# EasyEDA Pro project ProPrj_农装B类小车V2_2025-10-25.epro, board PCB7
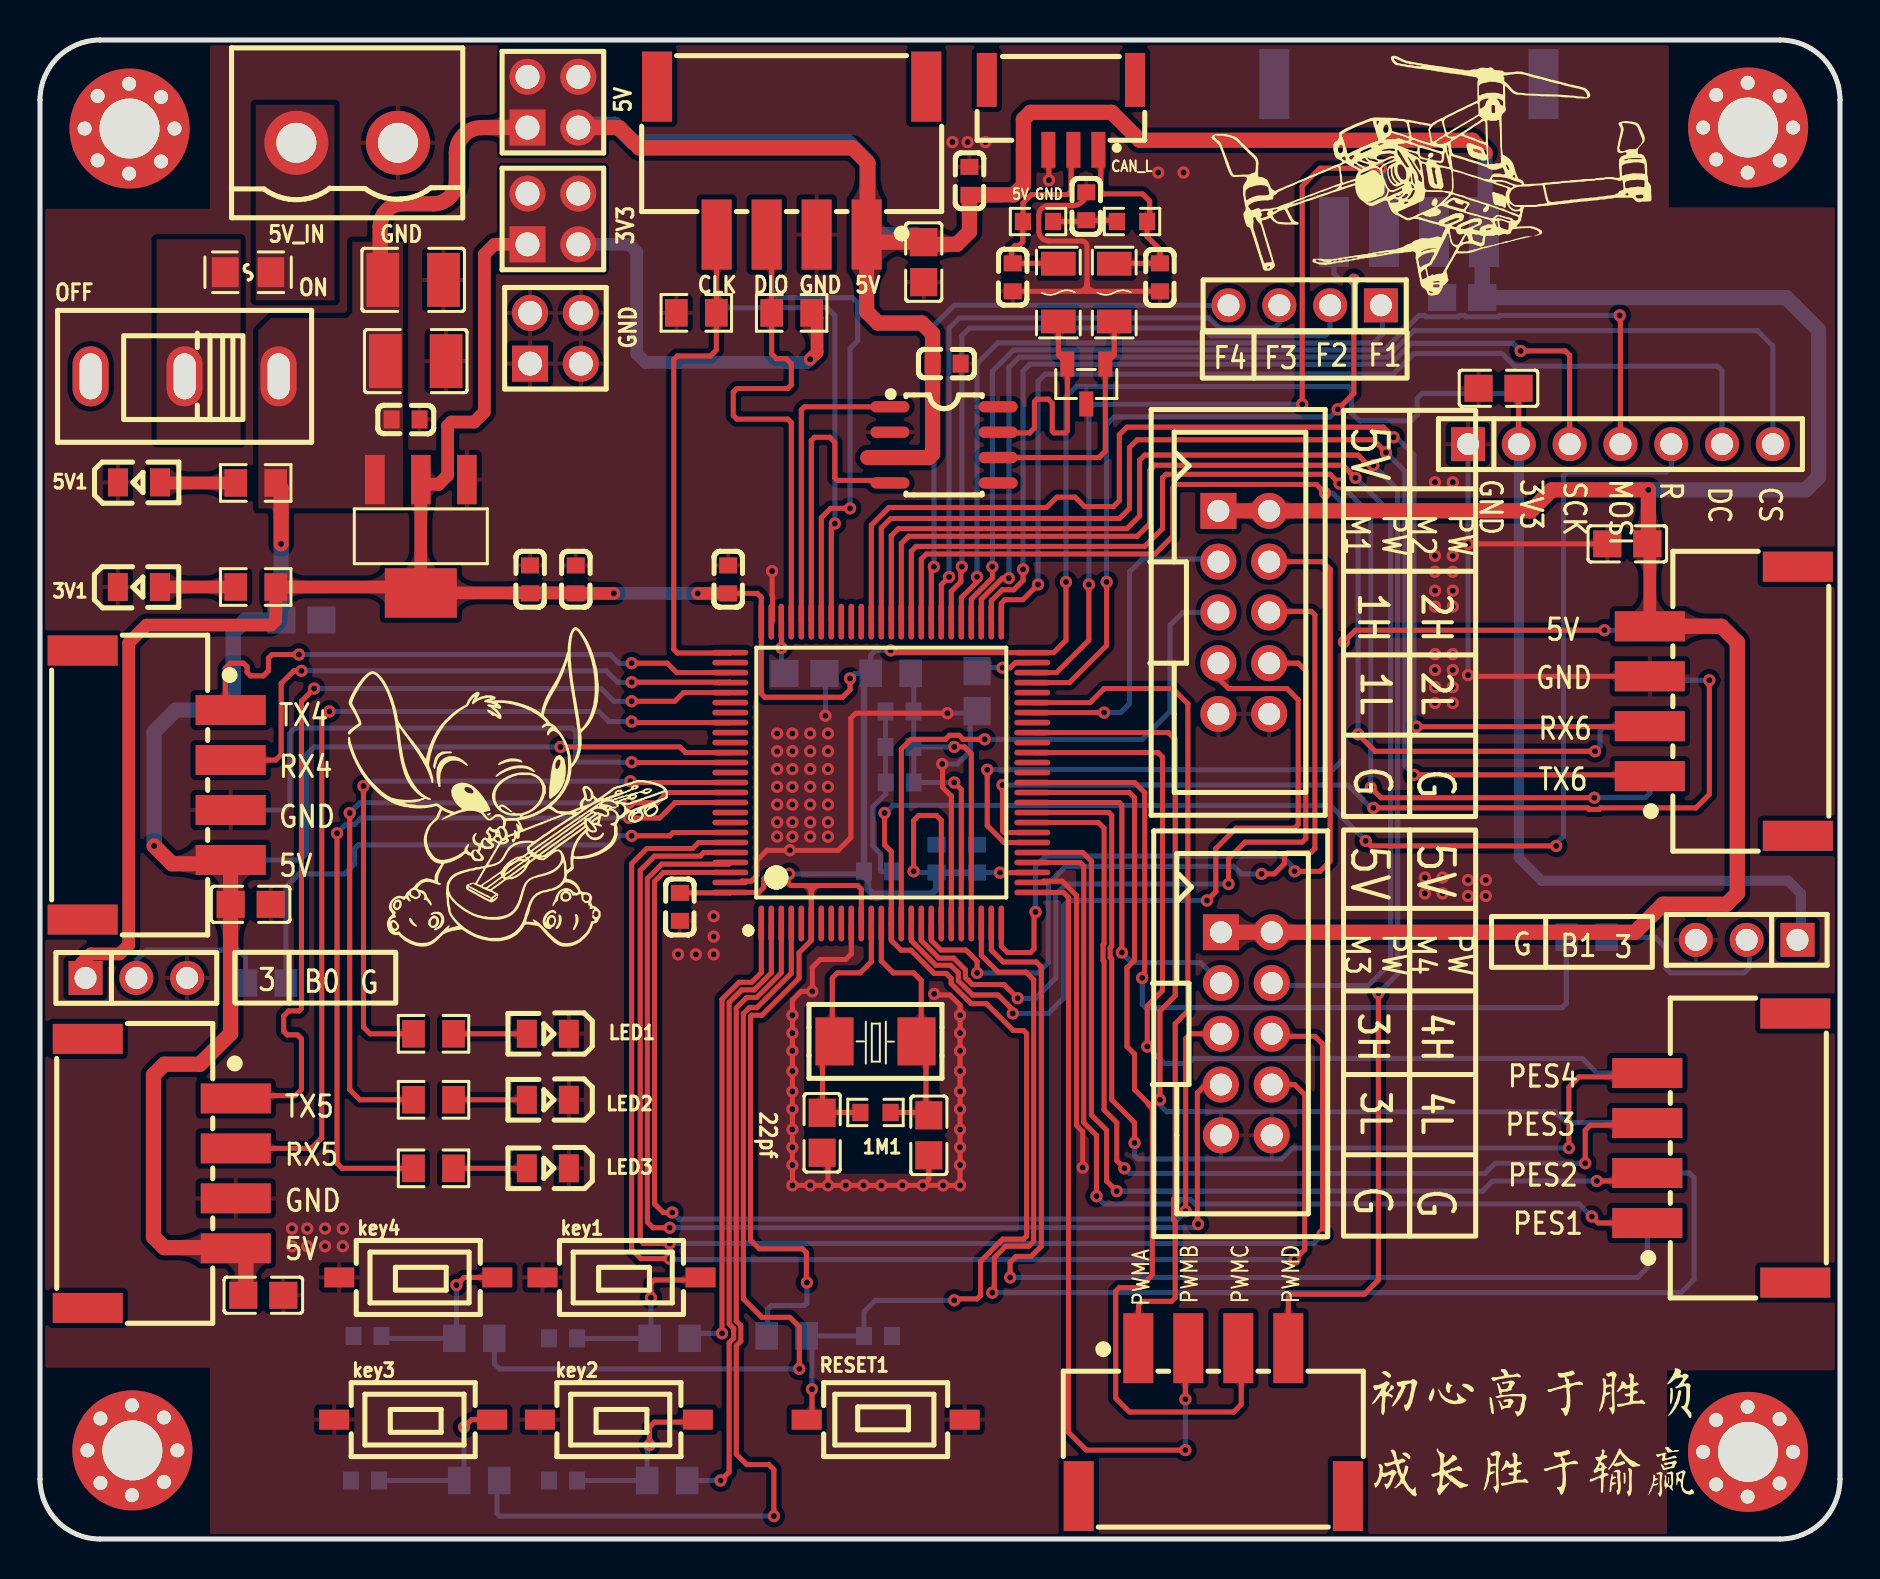
[diagram p2: board, top side]
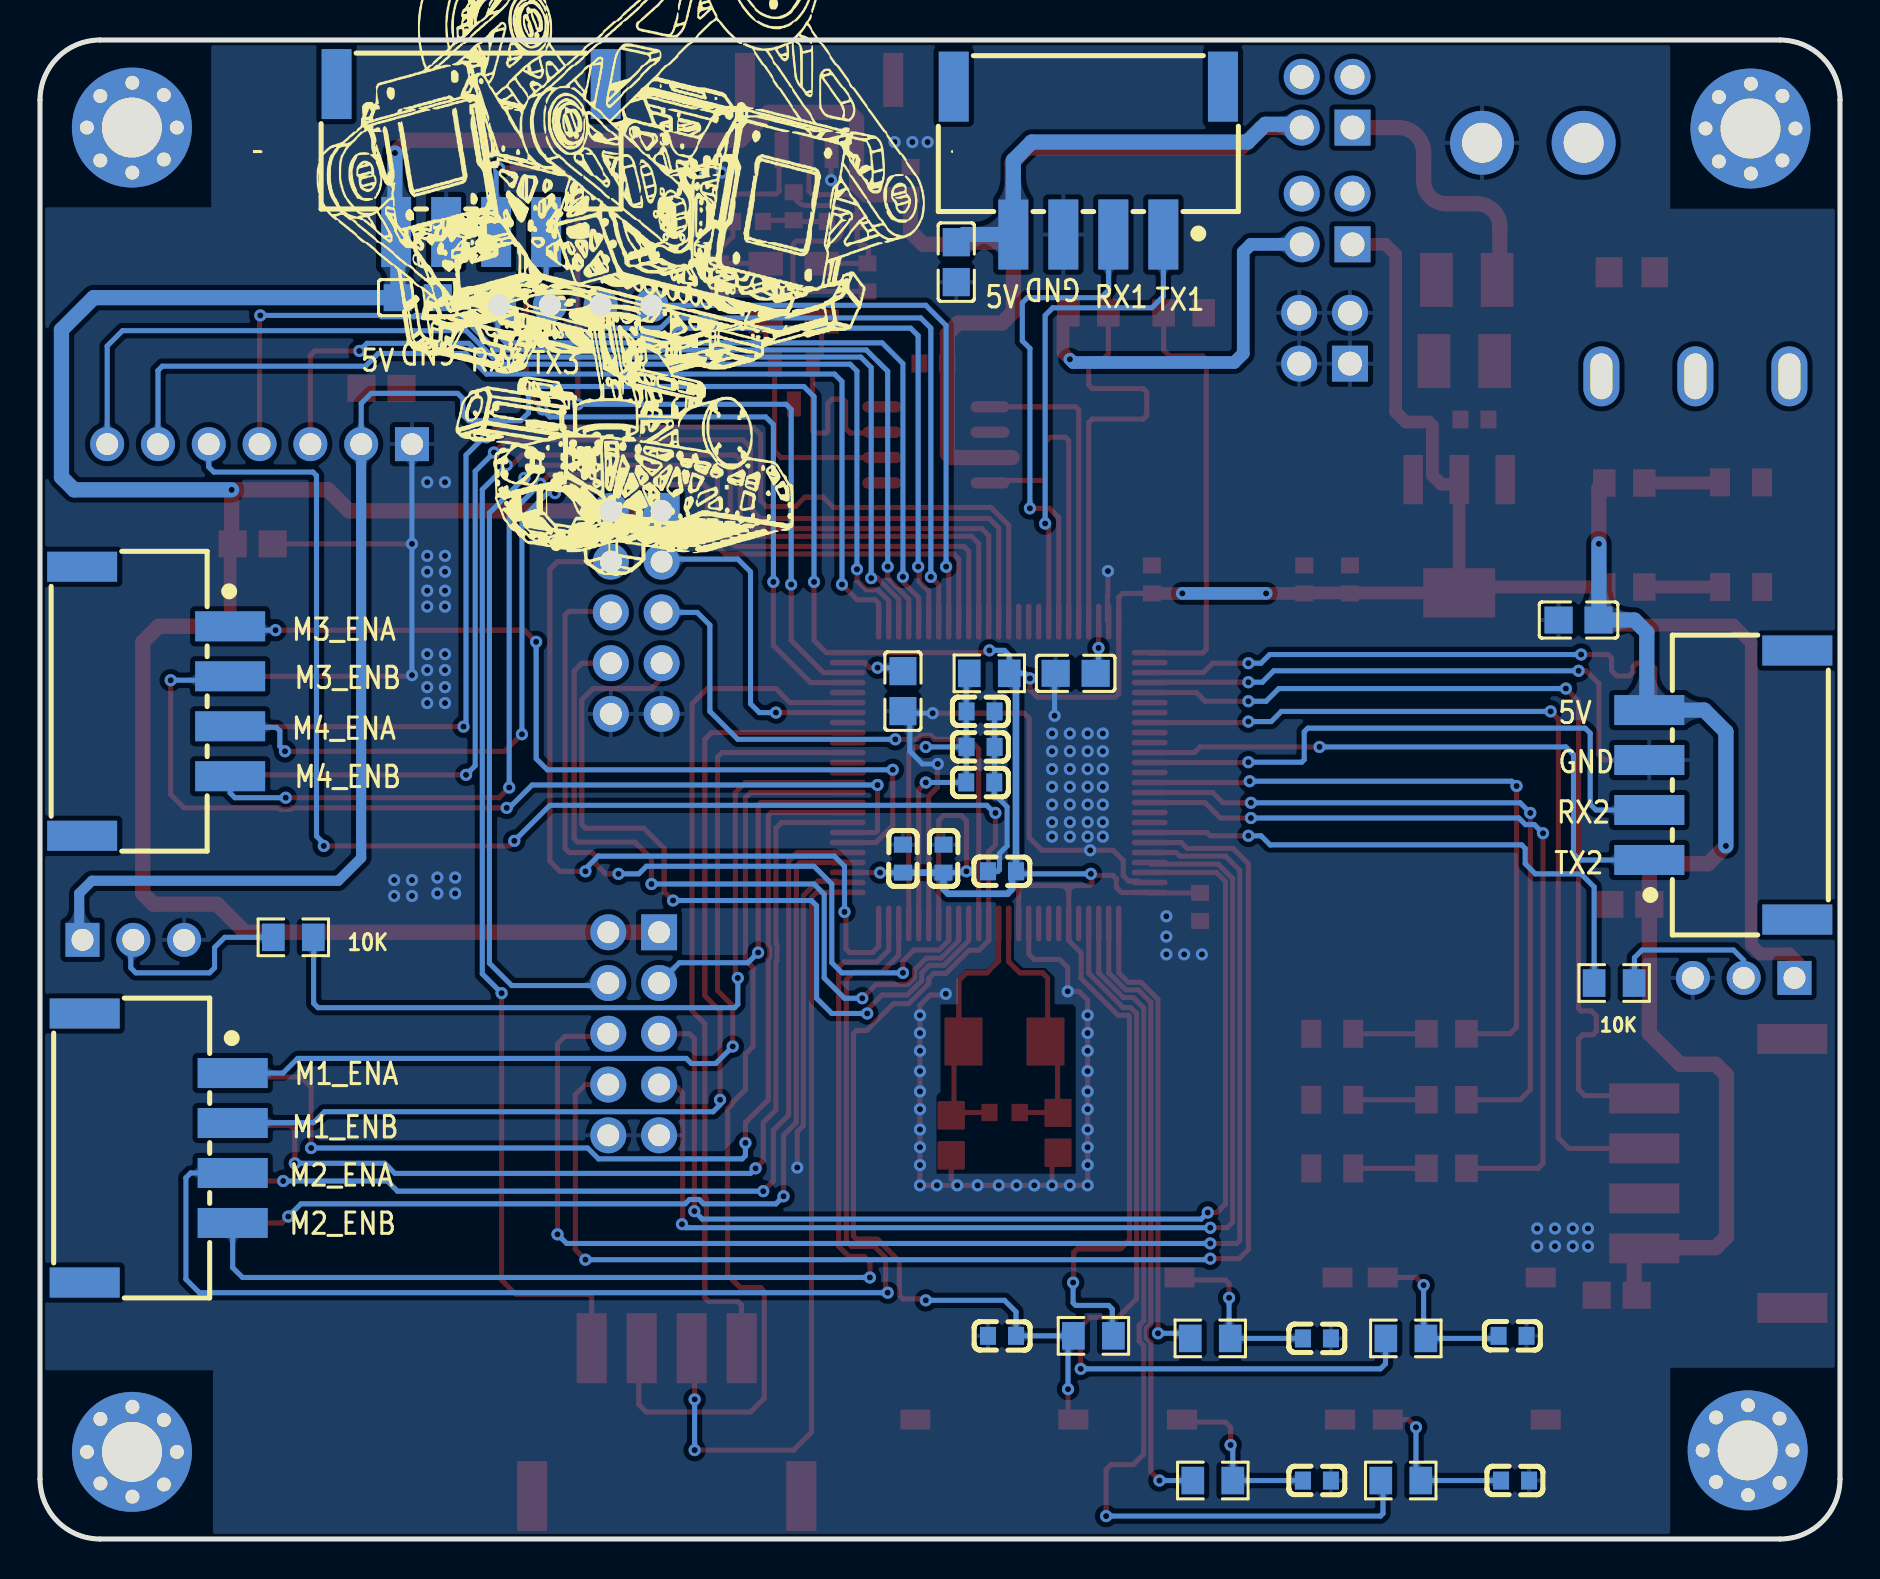
[diagram p3: board, bottom side, seen from below]

Outline 90 x 75 mm; copper layers: Top Layer, Bottom Layer. Coordinates in mm from the lower left corner of the outline.
Outline path: 0,72 arc(0.88,74.12) 3,75 87,75 arc(89.12,74.12) 90,72 90,3 arc(89.12,0.88) 87,0 3,0 arc(0.88,0.88) 0,3 0,72
Stack: Top Layer 0.035mm / Dielectric1 1.51mm FR4 er 4.5 / Bottom Layer 0.035mm

## Design rules (mm)
net OSC_OUT: DP1
net OSC_IN: DP1
net CAN1_L: DP4
net CAN1_H: DP4
net USART2_TX: DP7
net USART2_RX: DP7
net USART1_TX: DP6
net USART1_RX: DP6
net USART4_TX: DP8
net USART4_RX: DP8
net SWDIO: DP3
net SWCLK: DP3
net USART5_TX: DP9
net USART5_RX: DP9
net USART6_TX: DP10
net USART6_RX: DP10
net $1N59236: DP5
net $1N59237: DP5
net CAN1_RX: DP2
net CAN1_TX: DP2
template: 自定义配置
spacing copperThickness1oz (default): track to track 0.102, other pairs 0.152 to 0.3
spacing copperThickness2oz: track to track 0.203, other pairs 0.152 to 0.3
track width copperThickness1oz (default): min 0.127, default 0.254, max 2.54
track width copperThickness2oz: min 0.203, default 0.254, max 2.54
differential pair differentialPair (default): width min 0.127, default 0.254, max 2.54; gap min 0.152, default 0.152
via viaSize (default): diameter min 0.5, default 0.61, max 10; hole min 0.3, default 0.305, max 6.3
net $1N12322 uses copperRegion1

## Placement (name value [footprint] x y rotation side)
1M1  SCR0603J1K  [R0603]  41.77 21.34 0 top
3V1  NCD0805R1  [LED0805-R-RD]  4.94 47.63 0 top
5V1  NCD0805R1  [LED0805-R-RD]  4.95 52.86 0 top
10K  10K  [R0805]  11.29 27.82 180 bottom
C1  104  [C0603]  26.15 10.04 180 bottom
C1_22pf1  22pf  [C0805]  44.44 20.2 90 top
C2_22pf1  100nF  [C0805]  39.11 20.32 90 top
C5  104  [C0603]  46.85 34.04 270 bottom
C6  104  [C0603]  44.82 34.04 270 bottom
C7  104  [C0603]  32 31.63 90 top
C8  104  [C0603]  34.41 48.01 270 top
C9  104  [C0603]  41.9 33.41 180 bottom
C10  106  [C0603]  26.79 48.01 270 top
C22  104  [C0603]  45.33 58.81 0 top
C24  104  [C0805]  44.19 63.89 90 bottom
C25  104  [C0805]  72.93 57.57 0 top
C26  22p  [C0603]  56 63.12 90 top
C27  22p  [C0603]  52.31 66.68 90 top
C33_2.2uf1  100nF  [C0603]  42.99 37.85 0 bottom
C34_106  106  [C0603]  42.97 39.63 180 bottom
C35_104  104  [C0603]  42.97 41.41 180 bottom
C39  104  [C0603]  41.9 10.16 0 bottom
C40  104  [C0805]  44.19 63.89 270 top
C41  104  [C0805]  13.07 45.98 180 bottom
C42  104  [C0805]  71.11 62.11 0 bottom
C43  104  [C0805]  10.53 31.75 180 top
C44  2.2uf  [C0805]  46.85 42.42 270 bottom
C45  2.2uf  [C0805]  38.22 43.31 0 bottom
C52  104  [C0603]  18.28 56.01 180 top
C53  104  [C0603]  24.5 48.01 270 top
C54  100uF  [C1210]  18.66 63 0 top
C55  100uF  [C1210]  18.79 58.93 0 top
C56  104  [C0603]  26.15 2.93 180 bottom
C57  104  [C0603]  16.25 2.93 180 bottom
C58  104  [C0603]  16.37 10.16 180 bottom
C61  104  [C0805]  11.17 12.2 180 top
C63  104  [C0805]  79.37 49.79 0 top
C64  22p  [C0603]  48.63 63.12 270 top
C65  104  [C0603]  46.47 67.95 270 top
CN2  WAFER-XH2.54-4PWB  [CONN-TH_4P-P0.20_XUNPU_WAFER-XH2.54-4PWB]  5.83 37.72 90 bottom
CN3  WAFER-XH2.54-4PWB  [CONN-TH_4P-P0.20_XUNPU_WAFER-XH2.54-4PWB]  37.58 68.97 0 bottom
CN4  WAFER-XH2.54-4PWB  [CONN-TH_4P-P0.20_XUNPU_WAFER-XH2.54-4PWB]  68.44 69.09 0 bottom
CN5  WAFER-XH2.54-4PWB  [CONN-TH_4P-P0.20_XUNPU_WAFER-XH2.54-4PWB]  5.83 37.72 270 top
CN6  WAFER-XH2.54-4PWB  [CONN-TH_4P-P0.20_XUNPU_WAFER-XH2.54-4PWB]  37.58 68.97 180 top
CN15  WAFER-XH2.54-4PWB  [CONN-TH_4P-P0.20_XUNPU_WAFER-XH2.54-4PWB]  84.06 19.56 90 top
CN16  WAFER-XH2.54-4PWB  [CONN-TH_4P-P0.20_XUNPU_WAFER-XH2.54-4PWB]  58.66 5.85 0 top
CN24  DB2EVC-5.08-2P-GN  [CONN-TH_2P-P5.08_DB2EVC-5.08-2P]  15.36 69.85 180 top
CN25  WAFER-XH2.54-4PWB  [CONN-TH_4P-P0.20_XUNPU_WAFER-XH2.54-4PWB]  6.09 18.29 270 top
CN26  BH254V-10P  [IDC-TH_10P-P2.54-V-R2-C5-S2.54]  60.19 46.36 270 top
CN28  BH254V-10P  [IDC-TH_10P-P2.54-V-R2-C5-S2.54]  60.32 25.28 270 top
CN29  WAFER-XH2.54-4PWB  [CONN-TH_4P-P0.20_XUNPU_WAFER-XH2.54-4PWB]  84.19 41.91 90 top
CN30  WAFER-XH2.54-4PWB  [CONN-TH_4P-P0.20_XUNPU_WAFER-XH2.54-4PWB]  84.06 19.56 270 bottom
CN31  WAFER-XH2.54-4PWB  [CONN-TH_4P-P0.20_XUNPU_WAFER-XH2.54-4PWB]  84.19 41.91 270 bottom
CN32  GH125-S04DCA-00  [CONN-SMD_4P-P1.27_GH125-S04DCA-00]  51.05 71.25 180 top
D1  NUP2105LT1G-TP  [SOT-23-3_L2.9-W1.3-P1.90-LS2.4-BR]  52.31 57.79 90 top
F1  BSMD0805-100-6V  [F0805]  10.41 63.38 0 top
F3  nSMD020-30V  [F1206]  53.71 62.36 90 top
F4  nSMD020-30V  [F1206]  50.92 62.36 90 top
H7  H3  [HDR-TH_3P-P2.54-V-M]  4.82 28.07 0 top
H8  H3  [HDR-TH_3P-P2.54-V-M]  85.34 29.98 180 top
H25  PZ254V-11-07P  [HDR-TH_7P-P2.54-V-M]  79.02 54.78 0 top
H26  A2541WV-2x2P  [HDR-TH_4P-P2.54-V-R2-C2-S2.54_A2541WV-2X2P]  25.77 60.08 0 top
H27  A2541WV-2x2P  [HDR-TH_4P-P2.54-V-R2-C2-S2.54_A2541WV-2X2P]  25.64 71.89 0 top
H28  A2541WV-2x2P  [HDR-TH_4P-P2.54-V-R2-C2-S2.54_A2541WV-2X2P]  25.64 66.04 0 top
H29  PZ254V-11-04P  [HDR-TH_4P-P2.54-V-M]  63.24 61.73 180 top
key1  TS-1092S-B3D2-G  [SW-SMD_L6.1-W3.6-LS7.9]  29.07 13.09 180 top
key2  TS-1092S-B3D2-G  [SW-SMD_L6.1-W3.6-LS7.9]  28.95 5.97 180 top
key3  TS-1092S-B3D2-G  [SW-SMD_L6.1-W3.6-LS7.9]  18.66 5.97 180 top
key4  TS-1092S-B3D2-G  [SW-SMD_L6.1-W3.6-LS7.9]  18.91 13.09 180 top
LED1  NCD0805R1  [LED0805-R-RD]  25.39 25.28 180 top
LED2  NCD0805R1  [LED0805-R-RD]  25.39 21.98 180 top
LED3  NCD0805R1  [LED0805-R-RD]  25.39 18.55 180 top
NOREF  -  [Pad_e4715]  83.81 69.02 180 top
NOREF#2  -  [Pad_e4723]  86.98 2.78 0 top
NOREF#3  -  [Pad_e4727]  83.81 5.96 0 top
NOREF#4  -  [Pad_e4725]  83.81 2.73 0 top
NOREF#5  -  [Pad_e108]  4.6 2.2 180 top
NOREF#6  -  [Pad_e4701]  2.23 70.57 270 top
NOREF#7  -  [Pad_e104]  4.6 6.69 180 top
NOREF#8  -  [Pad_e4703]  6.06 68.92 180 top
NOREF#9  -  [Pad_e4712]  87.66 70.62 270 top
NOREF#10  -  [Pad_e4710]  85.38 72.86 0 top
NOREF#11  -  [Pad_e4698]  4.45 72.81 0 top
NOREF#12  -  [Pad_e4717]  83.81 72.25 180 top
NOREF#13  -  [Pad_e4714]  85.38 68.36 0 top
NOREF#14  -  [Pad_e4713]  86.98 68.97 180 top
NOREF#15  -  [Pad_e112]  4.62 4.44 180 top
NOREF#16  -  [Pad_e4721]  86.98 6.01 0 top
NOREF#17  -  [Pad_e4728]  85.38 6.62 180 top
NOREF#18  -  [Pad_e107]  3.02 2.81 0 top
NOREF#19  -  [Pad_e109]  6.2 2.86 0 top
NOREF#20  -  [Pad_e4699]  2.88 72.2 180 top
NOREF#21  -  [Pad_e4697]  6.06 72.15 180 top
NOREF#22  -  [Pad_e4729]  85.4 4.36 180 top
NOREF#23  -  [Pad_e4718]  85.41 70.62 0 top
NOREF#24  -  [Pad_e4705]  4.48 70.57 0 top
NOREF#25  -  [Pad_e4726]  83.16 4.36 270 top
NOREF#26  -  [Pad_e4724]  85.38 2.12 180 top
NOREF#27  -  [Pad_e111]  6.2 6.08 0 top
NOREF#28  -  [Pad_e4722]  87.65 4.36 270 top
NOREF#29  -  [Pad_e4711]  86.98 72.2 180 top
NOREF#30  -  [Pad_e4704]  6.73 70.57 270 top
NOREF#31  -  [Pad_e4716]  83.16 70.62 270 top
NOREF#32  -  [Pad_e105]  3.02 6.03 0 top
NOREF#33  -  [Pad_e106]  2.37 4.44 270 top
NOREF#34  -  [Pad_e4702]  4.45 68.31 0 top
NOREF#35  -  [Pad_e4700]  2.88 68.97 180 top
NOREF#36  -  [Pad_e110]  6.87 4.44 270 top
R6_1k1  1K  [R0805]  31.49 10.04 180 bottom
R7_1K1  1K  [R0805]  31.36 2.93 180 bottom
R8_1K1  1K  [R0805]  21.96 2.93 180 bottom
R10_2K1  2K  [R0805]  19.68 21.98 0 top
R10_2K2  2K  [R0805]  19.68 18.55 0 top
R10_10K1  10K  [R0805]  10.79 47.63 180 top
R10_10K2  10K  [R0805]  37.58 61.35 180 top
R10_10K3  10K  [R0805]  32.82 61.35 0 top
R13_2K1  2K  [R0805]  19.68 25.28 0 top
R13_10K1  10K  [R0805]  10.79 52.84 180 top
R19  60R  [R0603]  49.9 65.92 180 top
R20  60R  [R0603]  54.6 65.92 180 top
R27_0Ω1  0K  [R0805]  42.54 43.31 0 bottom
R29_10K1  10K  [R0805]  77.33 30.1 0 bottom
R30  10K  [R0805]  37.33 10.16 0 bottom
R31_1K1  1K  [R0805]  21.71 10.04 180 bottom
RESET1  TS-1092S-B3D2-G  [SW-SMD_L6.1-W3.6-LS7.9]  42.28 5.97 0 top
U3  单刀双掷  [SW-TH_SS-12D10-G050]  7.23 58.17 180 top
U4  -  [407vgt6]  43.68 39.88 45 top
U10  SK12D07VG3  [SOT-223-4_L6.5-W3.5-P2.30-LS7.0-BR]  19.04 50.17 90 top
U13  TJA1050T/CM,118  [SOIC-8_L5.0-W4.0-P1.27-LS6.0-BL]  45.2 54.74 270 top
X1  8MHz  [CRYSTAL-SMD_L5.0-W3.2]  41.77 24.9 0 top

## Footprints (pads in the part's own frame, mm; a bottom-side part is the same pattern mirrored in y, then rotated)
407vgt6
  oval 0.28x1.796 smd rot 135: 1(-11.809,-1.04) 2(-11.456,-1.393) 3(-11.101,-1.747) 4(-10.748,-2.1) 5(-10.394,-2.454) 6(-10.041,-2.808) 7(-9.687,-3.161) 8(-9.334,-3.514) 9(-8.98,-3.868) 10(-8.627,-4.221) 11(-8.273,-4.575) 12(-7.92,-4.929) 13(-7.566,-5.282) 14(-7.213,-5.636) 15(-6.859,-5.989) 16(-6.505,-6.343) 17(-6.152,-6.697) 18(-5.798,-7.05) 19(-5.445,-7.404) 20(-5.091,-7.757) 21(-4.737,-8.111) 22(-4.384,-8.464) 23(-4.03,-8.818) 24(-3.677,-9.171) 25(-3.323,-9.525) 51(7.354,1.152) 52(7,1.506) 53(6.646,1.859) 54(6.293,2.213) 55(5.939,2.567) 56(5.586,2.92) 57(5.232,3.273) 58(4.879,3.627) 59(4.525,3.981) 60(4.172,4.334) 61(3.818,4.688) 62(3.465,5.041) 63(3.111,5.395) 64(2.757,5.748) 65(2.404,6.102) 66(2.05,6.455) 67(1.697,6.809) 68(1.343,7.162) 69(0.99,7.516) 70(0.636,7.87) 71(0.282,8.223) 72(-0.071,8.577) 73(-0.424,8.931) 74(-0.778,9.284) 75(-1.131,9.637)
  oval 1.796x0.28 smd rot 135: 26(-1.131,-9.525) 27(-0.778,-9.171) 28(-0.424,-8.818) 29(-0.071,-8.464) 30(0.282,-8.111) 31(0.636,-7.758) 32(0.99,-7.404) 33(1.343,-7.05) 34(1.697,-6.697) 35(2.05,-6.343) 36(2.404,-5.989) 37(2.757,-5.636) 38(3.111,-5.282) 39(3.465,-4.928) 40(3.818,-4.575) 41(4.172,-4.221) 42(4.525,-3.868) 43(4.879,-3.514) 44(5.232,-3.161) 45(5.586,-2.808) 46(5.939,-2.454) 47(6.293,-2.1) 48(6.646,-1.747) 49(7,-1.393) 50(7.354,-1.04) 76(-3.324,9.637) 77(-3.677,9.284) 78(-4.03,8.931) 79(-4.384,8.577) 80(-4.737,8.223) 81(-5.091,7.87) 82(-5.445,7.516) 83(-5.798,7.162) 84(-6.152,6.809) 85(-6.505,6.455) 86(-6.859,6.102) 87(-7.213,5.748) 88(-7.566,5.395) 89(-7.92,5.042) 90(-8.273,4.688) 91(-8.627,4.334) 92(-8.98,3.981) 93(-9.334,3.627) 94(-9.688,3.273) 95(-10.041,2.92) 96(-10.395,2.567) 97(-10.748,2.213) 98(-11.101,1.859) 99(-11.456,1.506) 100(-11.809,1.152)
C0603
  rect 0.8x0.9 smd: 1(-0.7,0) 2(0.7,0)
C0805
  rect 1.41x1.35 smd: 1(-1,0) 2(1,0)
C1210
  rect 1.635x2.7 smd: 1(-1.518,0) 2(1.518,0)
CONN-SMD_4P-P1.27_GH125-S04DCA-00
  rect 0.7x1.8 smd: 1(-1.875,1.75) 2(-0.625,1.75) 3(0.625,1.75) 4(1.875,1.75)
  rect 1x2.7 smd: 5(3.705,-1.75) 6(-3.705,-1.75)
CONN-TH_2P-P5.08_DB2EVC-5.08-2P
  round 3.2 hole 2: 1(-2.54,0) 2(2.54,0)
CONN-TH_4P-P0.20_XUNPU_WAFER-XH2.54-4PWB
  rect 1.5x3.5 smd: 1(-3.75,3.7) 2(-1.25,3.7) 3(1.25,3.7) 4(3.75,3.7) 5(-6.73,-3.7) 6(6.73,-3.7)
CRYSTAL-SMD_L5.0-W3.2
  rect 1.9x2.401 smd: 1(-2.05,0) 2(2.05,0)
F0805
  rect 1.335x1.5 smd: 1(-1.143,0) 2(1.143,0)
F1206
  rect 1.19x1.728 smd: 1(-1.445,0) 2(1.445,0)
HDR-TH_3P-P2.54-V-M
  rect 1.7x1.7 hole 1.1: 1(-2.54,0)
  round 1.7 hole 1.1: 2(0,0) 3(2.54,0)
HDR-TH_4P-P2.54-V-M
  rect 1.7x1.7 hole 1.1: 1(-3.81,0)
  round 1.7 hole 1.1: 2(-1.27,0) 3(1.27,0) 4(3.81,0)
HDR-TH_4P-P2.54-V-R2-C2-S2.54_A2541WV-2X2P
  rect 1.8x1.8 hole 1.2: 1(-1.27,-1.27)
  round 1.8 hole 1.2: 2(-1.27,1.27) 3(1.27,-1.27) 4(1.27,1.27)
HDR-TH_7P-P2.54-V-M
  rect 1.7x1.7 hole 1.1: 1(-7.62,0)
  round 1.7 hole 1.1: 2(-5.08,0) 3(-2.54,0) 4(0,0) 5(2.54,0) 6(5.08,0) 7(7.62,0)
IDC-TH_10P-P2.54-V-R2-C5-S2.54
  rect 1.8x1.8 hole 1.1: 1(-5.08,-1.27)
  round 1.8 hole 1.1: 2(-5.08,1.27) 3(-2.54,-1.27) 4(-2.54,1.27) 5(0,-1.27) 6(0,1.27) 7(2.54,-1.27) 8(2.54,1.27) 9(5.08,-1.27) 10(5.08,1.27)
LED0805-R-RD
  rect 1x1.399 smd: 1(1.05,0) 2(-1.05,0)
Pad_e104
  round 1.2 hole 0.7: 1(0,0)
Pad_e105
  round 1.2 hole 0.7: 1(0,0)
Pad_e106
  round 1.2 hole 0.7: 1(0,0)
Pad_e107
  round 1.2 hole 0.7: 1(0,0)
Pad_e108
  round 1.2 hole 0.7: 1(0,0)
Pad_e109
  round 1.2 hole 0.7: 1(0,0)
Pad_e110
  round 1.2 hole 0.7: 1(0,0)
Pad_e111
  round 1.2 hole 0.7: 1(0,0)
Pad_e112
  round 6 hole 3: 1(0,0)
Pad_e4697
  round 1.2 hole 0.7: 1(0,0)
Pad_e4698
  round 1.2 hole 0.7: 1(0,0)
Pad_e4699
  round 1.2 hole 0.7: 1(0,0)
Pad_e4700
  round 1.2 hole 0.7: 1(0,0)
Pad_e4701
  round 1.2 hole 0.7: 1(0,0)
Pad_e4702
  round 1.2 hole 0.7: 1(0,0)
Pad_e4703
  round 1.2 hole 0.7: 1(0,0)
Pad_e4704
  round 1.2 hole 0.7: 1(0,0)
Pad_e4705
  round 6 hole 3: 1(0,0)
Pad_e4710
  round 1.2 hole 0.7: 1(0,0)
Pad_e4711
  round 1.2 hole 0.7: 1(0,0)
Pad_e4712
  round 1.2 hole 0.7: 1(0,0)
Pad_e4713
  round 1.2 hole 0.7: 1(0,0)
Pad_e4714
  round 1.2 hole 0.7: 1(0,0)
Pad_e4715
  round 1.2 hole 0.7: 1(0,0)
Pad_e4716
  round 1.2 hole 0.7: 1(0,0)
Pad_e4717
  round 1.2 hole 0.7: 1(0,0)
Pad_e4718
  round 6 hole 3: 1(0,0)
Pad_e4721
  round 1.2 hole 0.7: 1(0,0)
Pad_e4722
  round 1.2 hole 0.7: 1(0,0)
Pad_e4723
  round 1.2 hole 0.7: 1(0,0)
Pad_e4724
  round 1.2 hole 0.7: 1(0,0)
Pad_e4725
  round 1.2 hole 0.7: 1(0,0)
Pad_e4726
  round 1.2 hole 0.7: 1(0,0)
Pad_e4727
  round 1.2 hole 0.7: 1(0,0)
Pad_e4728
  round 1.2 hole 0.7: 1(0,0)
Pad_e4729
  round 6 hole 3: 1(0,0)
R0603
  rect 0.806x0.864 smd: 1(-0.753,0) 2(0.753,0)
R0805
  rect 1.133x1.377 smd: 1(-1,0) 2(1,0)
SOIC-8_L5.0-W4.0-P1.27-LS6.0-BL
  oval 0.569x1.95 smd: 1(-1.905,-2.705) 2(-0.635,-2.705) 3(0.635,-2.705) 4(1.905,-2.705) 5(1.905,2.705) 6(0.635,2.705) 7(-0.635,2.705) 8(-1.905,2.705)
SOT-23-3_L2.9-W1.3-P1.90-LS2.4-BR
  rect 1.25x0.7 smd: 1(1,-0.95) 2(1,0.95) 3(-1,0)
SOT-223-4_L6.5-W3.5-P2.30-LS7.0-BR
  rect 2.47x0.98 smd: 1(2.835,-2.3) 2(2.835,0) 3(2.835,2.3)
  rect 2.47x3.6 smd: 4(-2.835,0)
SW-SMD_L6.1-W3.6-LS7.9
  rect 1.5x1 smd: 1(-3.95,0) 2(3.95,0)
SW-TH_SS-12D10-G050
  oval 1.8x3 hole 1.1x2.3: 1(-4.7,0) 2(0,0) 3(4.7,0)

## Nets
GND: 3V1.2 5V1.2 C1.2 C1_22pf1.1 C2_22pf1.1 C5.1 C6.1 C7.1 C8.1 C9.1 C10.1 C22.2 C24.1 C25.1 C26.1 C27.2 C33_2.2uf1.1 C34_106.2 C35_104.2 C39.2 C40.2 C41.1 C42.1 C43.1 C44.2 C45.2 C52.1 C53.1 C54.2 C55.2 C56.2 C57.2 C58.2 C61.1 C63.1 C64.2 C65.1 CN2.3 CN3.3 CN4.3 CN5.3 CN6.2 CN24.1 CN25.3 CN26.9 CN26.10 CN28.9 CN28.10 CN29.3 CN32.3 D1.3 H7.3 H8.3 H25.1 H26.1 H26.2 H26.3 H26.4 key1.2 key2.2 key3.2 key4.2 LED1.2 LED2.2 LED3.2 R10_10K3.1 RESET1.2 U4.10 U4.20 U4.27 U4.74 U4.99 U10.1 U13.2 U13.8
VCC3V3: C5.2 C6.2 C7.2 C8.2 C9.2 C10.2 C25.2 C53.2 H7.1 H8.1 H25.2 H28.1 H28.2 H28.3 H28.4 R10_10K1.1 R10_10K2.1 R27_0Ω1.1 R30.1 U4.6 U4.11 U4.19 U4.28 U4.50 U4.75 U4.100 U10.2 U10.4
VCC5V: C22.1 C24.2 C40.1 C41.2 C42.2 C43.2 C52.2 C54.1 C55.1 C61.2 C63.2 C65.2 CN2.4 CN3.4 CN4.4 CN5.4 CN6.1 CN25.4 CN26.1 CN26.2 CN28.1 CN28.2 CN29.4 CN32.4 H27.1 H27.2 H27.3 H27.4 R13_10K1.1 U3.1 U10.3 U13.3
BOOT0: 10K.1 U4.94
BOOT1: R29_10K1.1 U4.37
CAN1_H: C64.1 CN32.2 F4.2 R19.2
CAN1_L: C26.2 CN32.1 F3.2 R20.1
CAN1_RX: U4.70 U13.4
CAN1_TX: U4.71 U13.1
FREE_PIN1: H29.1 U4.55
FREE_PIN2: H29.2 U4.56
FREE_PIN3: H29.3 U4.57
FREE_PIN4: H29.4 U4.58
KEY1: R6_1k1.1 U4.1
KEY2: R7_1K1.1 U4.2
KEY3: R8_1K1.1 U4.3
KEY4: R31_1K1.1 U4.4
LED1: R13_2K1.1 U4.89
LED2: R10_2K1.1 U4.90
LED3: R10_2K2.1 U4.91
M1_ENA: CN30.1 U4.40
M1_ENB: CN30.2 U4.42
M1_H: CN26.5 U4.15
M1_L: CN26.7 U4.16
M1_PWM: CN26.3 U4.44
M2_ENA: CN30.3 U4.23
M2_ENB: CN30.4 U4.24
M2_H: CN26.6 U4.18
M2_L: CN26.8 U4.17
M2_PWM: CN26.4 U4.25
M3_ENA: CN31.1 U4.31
M3_ENB: CN31.2 U4.32
M3_H: CN28.5 U4.98
M3_L: CN28.7 U4.97
M3_PWM: CN28.3 U4.35
M4_ENA: CN31.3 U4.59
M4_ENB: CN31.4 U4.60
M4_H: CN28.6 U4.96
M4_L: CN28.8 U4.95
M4_PWM: CN28.4 U4.61
OLED_CS: H25.7 U4.53
OLED_DC: H25.6 U4.51
OLED_MOSI: H25.4 U4.54
OLED_SCK: H25.3 U4.52
OSC_IN: 1M1.1 C2_22pf1.2 U4.12 X1.1
OSC_OUT: 1M1.2 C1_22pf1.2 U4.13 X1.2
PES1: CN15.1 U4.29
PES2: CN15.2 U4.30
PES3: CN15.3 U4.33
PES4: CN15.4 U4.34
POWER5V: F1.1 U3.2
PWMA: CN16.1 U4.45
PWMB: CN16.2 U4.26
PWMC: CN16.3 U4.36
PWMD: CN16.4 U4.62
RESET: C39.1 H25.5 R30.2 RESET1.1 U4.14
SWCLK: CN6.4 R10_10K3.2 U4.76
SWDIO: CN6.3 R10_10K2.2 U4.72
USART1_RX: CN3.2 U4.69
USART1_TX: CN3.1 U4.68
USART2_RX: CN2.2 U4.87
USART2_TX: CN2.1 U4.86
USART3_RX: CN4.2 U4.48
USART3_TX: CN4.1 U4.47
USART4_RX: CN5.2 U4.79
USART4_TX: CN5.1 U4.78
USART5_RX: CN25.2 U4.83
USART5_TX: CN25.1 U4.80
USART6_RX: CN29.2 U4.64
USART6_TX: CN29.1 U4.63
$1N12245: H8.2 R29_10K1.2
$1N12257: 3V1.1 R10_10K1.2
$1N12259: C44.1 U4.49
$1N12262: C33_2.2uf1.2 C34_106.1 C35_104.1 R27_0Ω1.2 U4.21 U4.22
$1N12267: 5V1.1 R13_10K1.2
$1N12270: C45.1 U4.73
$1N12297: U4.93
$1N12307: U4.92
$1N12322: CN24.2 F1.2
$1N12352: 10K.2 H7.2
$1N12469: C58.1 key4.1 R31_1K1.2
$1N12473: C56.1 key2.1 R7_1K1.2
$1N12474: C57.1 key3.1 R8_1K1.2
$1N12475: C1.1 key1.1 R6_1k1.2
$1N12476: LED1.1 R13_2K1.2
$1N12492: LED2.1 R10_2K1.2
$1N19894: U4.77
$1N22147: LED3.1 R10_2K2.2
$1N26955: U4.67
$1N26987: U4.66
$1N26989: U4.65
$1N27004: U4.7
$1N32120: U4.39
$1N47198: U4.41
$1N47206: U4.43
$1N47218: U4.46
$1N59236: D1.1 F3.1 U13.6
$1N59237: D1.2 F4.1 U13.7
$1N59244: C27.1 R19.1 R20.2

Pads without a net: CN2 5 6; CN3 5 6; CN4 5 6; CN5 5 6; CN6 5 6; CN15 5 6; CN16 5 6; CN25 5 6; CN29 5 6; CN30 5 6; CN31 5 6; CN32 5 6; NOREF 1; NOREF#2 1; NOREF#3 1; NOREF#4 1; NOREF#5 1; NOREF#6 1; NOREF#7 1; NOREF#8 1; NOREF#9 1; NOREF#10 1; NOREF#11 1; NOREF#12 1; NOREF#13 1; NOREF#14 1; NOREF#15 1; NOREF#16 1; NOREF#17 1; NOREF#18 1; NOREF#19 1; NOREF#20 1; NOREF#21 1; NOREF#22 1; NOREF#23 1; NOREF#24 1; NOREF#25 1; NOREF#26 1; NOREF#27 1; NOREF#28 1; NOREF#29 1; NOREF#30 1; NOREF#31 1; NOREF#32 1; NOREF#33 1; NOREF#34 1; NOREF#35 1; NOREF#36 1; U3 3; U4 5 8 9 38 81 82 84 85 88; U13 5

## Via types
v1: diameter 0.61, hole 0.305, Top Layer to Bottom Layer, 230 vias

## Routing (per net, layer and track width the routed paths; a pad name or vN(x,y) marks a point on that pad's centre or on a via; arc(x,y) is an arc through that point)
GND: length 145.7
  Top Layer w0.254: v1(45.37,41.32) 40.79,41.32 40.54,41.06 40.54,35.09 39.91,34.46 v1(37.49,34.46) 36.35,34.46 35.84,33.95 35.84,33.19 35.57,32.91 35.1,32.91 35.03,32.85 34.51,32.85 ; v1(36.6,48.43) 36.6,47.23 36.63,47.2 36.63,45.96 U4.74 ; C1_22pf1.1 44.44,18 v1(44.14,17.69) ; CN32.3 50.45,69.48 v1(50.45,67.99) ; U4.20 45.56,37.17 45.13,37.61 45.13,38.76 v1(45.11,38.78) ; v1(44.14,17.69) v1(45.16,17.69) v1(46,17.69) v1(46,18.71) v1(46,19.6) v1(46,20.49) v1(46,21.5) v1(46,22.39) v1(46,23.41) v1(46,24.43) v1(46,25.31) v1(46,26.2) 46,26.71 45.49,27.22 44.76,27.22 v1(44.71,27.27) ; v1(44.14,17.69) v1(43.12,17.69) v1(42.06,17.69) v1(41.18,17.69) v1(40.29,17.69) v1(39.4,17.69) ; U4.27 50.13,32.85 50.19,32.91 51.11,32.91 51.83,32.19 51.83,20.69 52.14,20.38 v1(52.14,18.58) ; C2_22pf1.1 39.4,19.03 v1(39.4,17.69) ; 52.34,62.42 52.73,62.42 ; 52.34,62.42 51.93,62.42 ; 52.34,62.42 arc(52.35,62.43) 52.35,62.44 52.35,62.8 ; 52.73,62.42 C26.1 ; 52.73,62.42 arc(52.46,62.54) 52.35,62.8 ; U4.10 40.56,29.28 40.29,29 39.02,29 38.61,28.59 v1(38.61,27.4) 38.05,27.4 37.62,26.97 v1(37.62,26.2) v1(37.62,25.31) v1(37.62,24.43) v1(37.62,23.41) v1(37.62,22.39) v1(37.62,21.5) v1(37.62,20.49) ; 51.93,62.42 C64.2 ; 51.93,62.42 arc(52.23,62.55) 52.35,62.85 ; 52.35,62.8 52.35,62.85 ; 37.62,20.11 v1(37.62,19.6) v1(37.62,18.71) v1(37.62,17.69) v1(38.51,17.69) v1(39.4,17.69) ; 52.35,62.85 52.35,64.68 arc(52.28,64.86) 52.1,64.94 50.45,64.94 arc(50.09,65.09) 49.94,65.45 49.94,66.21 arc(49.95,66.31) 49.98,66.41 arc(50.03,66.51) 50.11,66.59 arc(50.27,66.68) 50.45,66.72 51.65,66.72 arc(52.12,66.91) C27.2 ; C63.1 v1(71.4,49.79) ; v1(71.4,43.22) 71.46,43.16 CN29.3
  Bottom Layer w0.254: v1(71.4,43.22) v1(71.4,49.79) H25.1 ; 46.75,41.32 46.51,41.08 46.51,39.41 45.87,38.78 v1(45.11,38.78) ; 46.75,41.32 C44.2 ; 46.75,41.32 v1(45.37,41.32) ; C9.1 42.1,33.41 42.03,33.48 42.03,34.29 41.65,34.68 41.65,36.63 42.29,37.27 C33_2.2uf1.1 42.27,37.87 C34_106.2 C35_104.2 ; v1(39.27,41.19) 39.27,43.26 C45.2
  vias: v1(12.6,15.54) v1(12.6,14.65) v1(13.36,15.54) v1(13.36,14.65) v1(14.25,15.54) v1(14.25,14.65) v1(15.14,15.54) v1(15.14,14.65) v1(31.9,29.25) v1(32.79,29.25) v1(33.68,31.16) v1(33.68,30.14) v1(33.68,29.25) v1(36.86,40.3) v1(36.86,39.41) v1(36.86,38.52) v1(36.86,37.63) v1(36.86,36.74) v1(36.86,35.86) v1(36.86,35.14) v1(37.62,40.3) v1(37.62,39.41) v1(37.62,38.52) v1(37.62,37.63) v1(37.62,36.74) v1(37.62,35.86) v1(37.62,35.14) v1(38.51,40.3) v1(38.51,39.41) v1(38.51,38.52) v1(38.51,37.63) v1(38.51,36.74) v1(38.51,35.86) v1(38.51,35.14) v1(39.4,40.3) v1(39.4,39.41) v1(39.4,38.52) v1(39.4,37.63) v1(39.4,36.74) v1(39.4,35.86) v1(39.4,35.14) v1(45.62,69.89) v1(46.38,69.89) v1(47.27,69.89) v1(55.91,68.37) v1(57.18,68.37) v1(69.24,33.1) v1(69.24,32.3) v1(69.75,52.87) v1(69.75,49.19) v1(69.75,48.39) v1(69.75,47.45) v1(69.75,46.65) v1(69.75,44.27) v1(69.75,43.48) v1(69.75,42.62) v1(69.75,41.82) v1(70.13,33.1) v1(70.13,32.3) v1(70.64,52.87) v1(70.64,49.19) v1(70.64,48.39) v1(70.64,47.45) v1(70.64,46.65) v1(70.64,44.27) v1(70.64,43.48) v1(70.64,42.62) v1(70.64,41.82) v1(71.4,32.97) v1(71.4,32.17) v1(72.29,32.97) v1(72.29,32.17)
VCC3V3: length 273.9
  Top Layer w0.254: 38.2,32.7 38.14,32.7 ; 38.2,32.7 38.26,32.7 arc(38.48,32.61) 38.56,32.4 ; 38.2,32.7 arc(38.46,32.59) 38.56,32.33 ; 38.56,32.28 arc(38.69,32.58) 38.98,32.7 39,32.7 ; 38.56,32.24 38.56,32.22 ; 38.94,32.7 38.99,32.7 ; v1(43.68,33.41) 43.68,35.95 43.93,36.2 44.82,36.2 45.06,35.96 U4.19 ; v1(38.34,12.83) 38.32,12.86 38.32,14.33 38.13,14.52 35.97,14.52 35.53,14.96 35.53,26.14 35.59,26.2 36.1,26.2 37.95,28.06 37.95,29.33 38.56,29.95 U4.6 38.56,32.68 38.55,32.7 ; v1(42.53,44.46) 42.64,44.35 U4.50 50.68,44.35 51.3,44.96 v1(51.3,47.88) ; H25.2 73.93,54.79 C25.2 ; v1(48,33.34) 49.61,33.34 49.61,33.35 ; C7.2 34.5,32.33 34.51,32.35 35.93,32.35 36.19,32.6 36.19,33.02 36.37,33.2 37.38,33.2 v1(37.46,33.28) 37.46,33.18 37.4,33.13 37.4,32.82 37.53,32.7 38.55,32.7 ; v1(40.5,43.06) 40.5,42.5 40.12,42.12 36.24,42.12 36.06,42.3 U4.75 36.06,47.12 35.87,47.31 C8.2 ; 38.55,32.7 40.88,32.7 41.06,32.52 41.06,30.8
  Top Layer w0.635: U10.4 26.76,47.33 C10.2 v1(28.69,47.31) ; U10.4 18.75,47.63 R10_10K1.1 11.79,45.96 11.55,45.72 5.33,45.72 4.44,44.84 4.44,29.72 3.99,29.27 2.53,29.27 2.08,28.82 2.08,28.19 2.24,28.03 ; U10.4 U10.2 19.28,52.77 19.93,52.77 20.38,53.22 20.38,55.7 20.56,55.88 21.71,55.88 22.22,56.39 22.22,64.27 22.72,64.77 H28.1 ; v1(32.88,47.31) 34.28,47.31 ; R10_10K2.1 38.85,61.08 38.85,59.37 v1(38.51,59.03)
  Bottom Layer w0.254: v1(38.34,12.83) 38.34,11.82 38.22,11.69 36.57,11.69 36.39,11.51 36.39,10.22 R30.1 ; H25.2 73.94,56.81 73.43,57.32 69.12,57.32 68.86,57.06 68.86,56.24 68.57,55.95 65.97,55.95 65.58,56.34 65.58,57.48 65.4,57.66 51.81,57.66 51.3,57.15 v1(51.3,47.88) ; v1(43.68,33.41) 43.74,33.34 C6.2 ; C5.2 v1(48,33.34) ; C9.2 41.07,33.28 v1(37.46,33.28) ; v1(40.5,43.06) 40.76,43.31 R27_0Ω1.1 41.54,44.22 41.78,44.46 v1(42.53,44.46)
  Bottom Layer w0.33: C5.2 C6.2 44.82,32.52 44.59,32.28 41.63,32.28 41.39,32.52 41.39,33.21 C9.2 41.2,42.98 R27_0Ω1.1
  Bottom Layer w0.508: H25.2 73.94,34.08 75.08,32.93 87.4,32.93 88.04,32.3 88.04,30.14 H8.1
  Bottom Layer w0.635: v1(28.69,47.31) v1(32.88,47.31) ; H28.3 29.46,64.77 29.84,64.39 29.84,59.31 30.29,58.86 38.34,58.86 v1(38.51,59.03)
VCC5V: length 278.5
  Top Layer w0.635: CN29.4 80.49,49.66 C63.2
  Top Layer w0.762: 10.29,12.2 10.29,14.04 CN25.4 9.75,14.58 6.21,14.58 5.68,15.12 5.68,23.22 6.21,23.75 7.99,23.75 9.53,25.29 CN5.4 ; 9.14,33.79 6.59,33.79 v1(5.71,34.68) ; H27.1 22.09,70.62 arc(21.19,70.25) 20.82,69.35 20.82,67.95 arc(20.48,67.14) 19.68,66.81 18.15,66.81 arc(17.34,66.47) 17.01,65.66 17.01,63.13 arc(17.05,63.04) C54.1 ; CN6.1 41.33,61.41 41.9,60.84 44.09,60.84 44.63,60.3 C22.1 44.63,54.3 44.44,54.11 U13.3 41.39,54.11 ; CN6.1 41.71,64.89 C40.1 44.3,64.77 45.84,64.77 46.47,65.41 C65.2 48.69,67.25 49.17,67.73 CN32.4 49.17,71.03 49.52,71.38 53.59,71.38 54.98,69.98 71.62,69.98 v1(72.25,69.35) ; CN6.1 41.39,65.33 41.39,68.84 40.63,69.6 29.96,69.6 28.95,70.62 H27.3 ; CN26.1 CN26.2 74.54,51.44 75.59,52.49 v1(80.42,52.49) 80.42,49.84 C63.2 ; R13_10K1.1 12.06,52.57 v1(12.06,49.79) ; CN28.1 CN28.2 79.75,30.36 81.15,31.76 84.32,31.76 84.86,32.3 84.86,44.87 84.07,45.66 CN29.4
  Bottom Layer w0.762: C40.1 43.81,65.27 CN6.1 41.33,68.97 40.41,69.89 29.62,69.89 28.73,70.78 27.08,70.78 H27.3 ; v1(80.42,52.49) 88.29,52.49 88.93,53.13 88.93,60.49 87.31,62.11 C42.2 72.11,65.39 72.25,65.45 ; v1(12.06,49.79) 12.06,46.09 11.95,45.98 10.28,45.98 9.66,45.36 9.66,41.47 CN2.4 6.79,41.47 5.71,40.39 v1(5.71,34.68) ; 72.25,65.45 v1(72.25,69.35) ; 72.25,65.45 72.19,65.39
BOOT0: length 28.6
  Top Layer w0.254: 34.51,35.35 31.65,35.35 31.49,35.18 v1(29.58,35.18)
  Bottom Layer w0.254: v1(29.58,35.18) 28.95,35.18 28.49,34.73 15.92,34.73 15.74,34.55 15.74,33.79 15.23,33.28 12.95,33.28 12.29,32.63 10K.1
BOOT1: length 41.2
  Top Layer w0.254: v1(55.11,28.07) 55.24,28.2 55.24,37.34 54.73,37.85 49.61,37.85
  Bottom Layer w0.254: v1(55.11,28.07) 55.11,26.75 55.27,26.58 76.1,26.58 76.32,26.8 76.32,30.09 R29_10K1.1
CAN1_H: length 10.4
  Top Layer w0.254: 51.67,69.5 51.55,69.38 51.55,67.44 51.37,67.26 49.57,67.26 49.15,66.84 49.15,65.92 49.14,65.91 49.14,64.9 48.96,64.72 48.76,64.72 48.58,64.54 48.58,63.88 C64.1 50.9,63.82 F4.2
CAN1_L: length 10.4
  Top Layer w0.254: R20.1 55.35,65.16 56,64.52 C26.2 53.73,63.82 F3.2 ; CN32.1 53.04,69.38 53.04,67.44 53.19,67.3 55.12,67.3 55.48,66.94 55.48,65.92
CAN1_RX: length 15.1
  Top Layer w0.254: U4.70 38.56,54.96 38.73,55.12 39.49,55.12 39.74,54.87 39.74,53.09 39.87,52.96 42.24,52.96 42.5,52.71
CAN1_TX: length 15.1
  Top Layer w0.254: U4.71 38.06,56.49 38.22,56.65 U13.1
FREE_PIN1: length 35.6
  Top Layer w0.254: U4.55 46.06,47.09 46.85,47.88 v1(46.85,48.14)
  Bottom Layer w0.254: H29.1 67.11,61.66 67.11,60.27 66.69,59.85 47.9,59.85 46.85,58.81 v1(46.85,48.14)
FREE_PIN2: length 34.6
  Top Layer w0.254: v1(46.09,48.65) 46.04,48.59 46.04,47.9 45.56,47.42 U4.56
  Bottom Layer w0.254: v1(46.09,48.65) 46.09,60.2 46.47,60.58 58.16,60.58 58.54,60.2 64.25,60.2 64.51,60.46 H29.2
FREE_PIN3: length 32.8
  Top Layer w0.254: U4.57 45.06,47.74 v1(45.46,48.14)
  Bottom Layer w0.254: H29.3 61.97,60.84 61.71,60.58 59.05,60.58 59.03,60.6 58.96,60.6 58.47,61.09 45.97,61.09 45.46,60.58 v1(45.46,48.14)
FREE_PIN4: length 30
  Top Layer w0.254: U4.58 44.56,48.52 v1(44.69,48.65)
  Bottom Layer w0.254: v1(44.69,48.65) 44.69,60.71 45.71,61.73 H29.4
KEY1: length 23.4
  Top Layer w0.254: v1(34.1,10.29) 34.1,27 34.95,27.85 35.59,27.85 36.06,28.33 U4.1
  Bottom Layer w0.254: R6_1k1.1 32.74,10.29 v1(34.1,10.29)
KEY2: length 31.1
  Top Layer w0.254: v1(34.03,2.93) 34.46,3.36 34.46,9.82 34.69,10.05 34.69,10.53 34.46,10.76 34.46,26.85 35.08,27.47 35.71,27.47 36.56,28.33 U4.2
  Bottom Layer w0.254: v1(34.03,2.93) R7_1K1.1
KEY3: length 48.1
  Top Layer w0.254: v1(36.69,1.15) 36.69,3.47 36.44,3.72 35.33,3.72 34.81,4.24 34.81,9.67 35.04,9.9 35.04,10.68 34.81,10.91 34.81,26.57 35.33,27.09 35.83,27.09 37.06,28.32 U4.3
  Bottom Layer w0.254: v1(36.69,1.15) 22.98,1.15 22.85,1.27 22.85,2.81 R8_1K1.1
KEY4: length 42.1
  Top Layer w0.254: v1(37.96,8.51) 37.96,10.62 37.49,11.09 36.1,11.09 35.17,12.02 35.17,26.29 35.47,26.58 35.84,26.58 37.56,28.31 U4.4
  Bottom Layer w0.254: v1(37.96,8.51) 22.98,8.51 22.72,8.77 22.72,10.02 R31_1K1.1
LED1: length 33.2
  Top Layer w0.254: v1(16.17,37.67) 16.17,25.61 16.5,25.28 R13_2K1.1 ; 34.51,37.85 29.59,37.85 v1(29.52,37.91)
  Bottom Layer w0.254: v1(29.52,37.91) 16.41,37.91 v1(16.17,37.67)
LED2: length 36.7
  Top Layer w0.254: R10_2K1.1 15.99,21.98 15.48,22.48 v1(15.48,36.33) ; 34.51,37.35 31.37,37.35 30.85,36.83 v1(29.46,36.83)
  Bottom Layer w0.254: v1(29.46,36.83) 15.99,36.83 v1(15.48,36.33)
LED3: length 40.7
  Top Layer w0.254: R10_2K2.1 15.1,18.55 14.85,18.8 v1(14.85,35.31) ; v1(29.46,36.07) 30.98,36.07 31.75,36.85 34.51,36.85
  Bottom Layer w0.254: v1(29.46,36.07) 16.06,36.07 15.73,35.74 15.28,35.74 v1(14.85,35.31)
M1_ENA: length 47.2
  Top Layer w0.254: 49.61,39.35 55.9,39.35 56.12,39.12 56.12,27.44 55.36,26.67 v1(55.36,24.64)
  Bottom Layer w0.254: CN30.1 77.85,23.31 77.12,24.04 57.69,24.04 57.43,23.79 56.22,23.79 v1(55.36,24.64)
M1_ENB: length 50.6
  Top Layer w0.254: v1(56,21.98) 56,26.42 56.76,27.18 56.76,40.01 56.42,40.35 49.61,40.35
  Bottom Layer w0.254: v1(56,21.98) 56,21.72 56.34,21.38 75.77,21.38 76.32,20.83 80.34,20.83 CN30.2
M1_H: length 30.1
  Top Layer w0.254: U4.15 43.06,39.52 43.55,40.01 45.27,40.01 45.47,40.21 45.95,40.21 46.16,40.01 v1(47.24,40.01)
  Bottom Layer w0.254: CN26.5 57.14,46.36 56.51,45.72 56.51,41.41 55.11,40.01 v1(47.24,40.01)
M1_L: length 41.4
  Top Layer w0.254: 58.92,43.82 58.92,43.06 59.43,42.55 62.35,42.55 62.91,41.99 62.91,35.74 62.73,35.56 59.81,35.56 58.79,34.55 58.79,32.39 v1(58.35,31.95) ; U4.16 43.56,29.94 44.8,28.71 45.53,28.71 45.91,28.33 45.91,27.94 46.63,27.22 47.9,27.22 48.64,26.48 v1(48.64,26.29)
  Bottom Layer w0.254: v1(48.64,26.29) 50.41,26.29 51.17,27.06 51.17,31.69 51.43,31.95 v1(58.35,31.95)
M1_PWM: length 16.4
  Top Layer w0.254: 49.61,41.35 v1(53.2,41.35)
  Bottom Layer w0.254: CN26.3 58.79,49.03 55.11,49.03 54.47,48.39 54.47,41.79 54.03,41.35 v1(53.2,41.35)
M2_ENA: length 64.8
  Top Layer w0.254: U4.23 47.06,29.2 47.91,28.36 49.3,28.36 49.68,27.98 49.68,14.9 49.43,14.65 48.29,14.65 47.72,14.08 47.72,12.42 v1(47.62,12.32)
  Bottom Layer w0.254: v1(47.62,12.32) 82.03,12.32 82.7,13 82.7,18.08 82.47,18.31 CN30.3
M2_ENB: length 55.1
  Top Layer w0.254: U4.24 47.56,29.47 48.16,28.87 49.81,28.87 50.07,28.62 50.07,14.65 49.56,14.14 48.8,14.14 48.5,13.85 v1(48.5,13.09)
  Bottom Layer w0.254: CN30.4 80.37,13.58 79.87,13.09 v1(48.5,13.09)
M2_H: length 40.5
  Top Layer w0.254: U4.18 44.56,29.95 45.04,29.47 46.3,29.47 46.85,28.91 v1(46.85,28.33) ; CN26.6 61.51,46.41 63.57,46.41 63.75,46.23 63.75,34.55 63.54,34.35 62.4,34.35 62.22,34.17 62.22,33.79 61.71,33.28 v1(61.08,33.28)
  Bottom Layer w0.254: v1(61.08,33.28) 60.06,33.28 59.68,33.66 51.3,33.66 50.41,32.77 50.41,28.83 49.9,28.33 v1(46.85,28.33)
M2_L: length 38.4
  Top Layer w0.254: U4.17 44.06,29.94 44.94,29.06 45.68,29.06 46.27,28.48 46.27,28.08 46.61,27.74 48.2,27.74 v1(48.89,27.06) ; 61.46,43.82 62.91,43.82 63.29,43.44 63.29,35.05 63.11,34.87 60.25,34.87 59.43,34.04 v1(59.43,32.77)
  Bottom Layer w0.254: v1(48.89,27.06) 49.78,27.06 50.79,28.07 50.79,32.26 51.3,32.77 v1(59.43,32.77)
M2_PWM: length 40.5
  Top Layer w0.254: CN26.4 64.13,48.9 64.51,48.52 64.51,33.91 64,33.41 v1(62.73,33.41) ; U4.25 48.06,29.66 48.38,29.34 49.52,29.34 49.7,29.52 49.7,31.3 v1(49.78,31.37)
  Bottom Layer w0.254: v1(62.73,33.41) 62.73,33.53 62.09,34.17 50.28,34.17 49.78,33.66 v1(49.78,31.37)
M3_ENA: length 44.9
  Top Layer w0.254: v1(78.22,45.47) 65.78,45.47 v1(65.19,44.89) ; U4.31 48.21,34.85 47.36,35.69 v1(47.36,38.49)
  Bottom Layer w0.254: v1(47.36,38.49) 64.63,38.49 65.19,39.04 v1(65.19,44.89) ; CN31.1 80.3,45.47 v1(78.22,45.47)
M3_ENB: length 48.7
  Top Layer w0.254: 49.61,35.35 48.21,35.35 48.12,35.44 v1(48.12,37.72) ; v1(66.67,36.58) 77.4,36.58 77.47,36.5 77.96,36.5 78.03,36.58 82.79,36.58 83.47,37.25 v1(83.47,42.97)
  Bottom Layer w0.254: CN31.2 80.69,42.97 v1(83.47,42.97) ; v1(48.12,37.72) 65.4,37.72 66.54,36.58 v1(66.67,36.58)
M3_H: length 57.6
  Top Layer w0.254: v1(57.28,16.4) 57.28,25.04 57.52,25.28 CN28.5 ; v1(31.61,16.34) 31.16,16.34 30.72,16.77 30.72,32.9 31.18,33.35 34.51,33.35
  Bottom Layer w0.254: v1(31.61,16.34) 31.94,16.01 56.89,16.01 v1(57.28,16.4)
M3_L: length 57.3
  Top Layer w0.254: v1(57.9,15.75) 57.87,15.79 57.87,22.32 58.28,22.74 CN28.7 ; v1(31.49,15.57) 30.65,15.57 30.37,15.85 30.37,33.05 31.09,33.77 34.43,33.77 34.51,33.85
  Bottom Layer w0.254: v1(31.49,15.57) 57.72,15.57 v1(57.9,15.75)
M3_PWM: length 17.5
  Top Layer w0.254: U4.35 53.95,36.85 54.09,36.71 v1(54.09,29.34)
  Bottom Layer w0.254: v1(54.09,29.34) 54.6,28.83 58.03,28.83 59.05,27.82
M4_ENA: length 55.3
  Top Layer w0.254: v1(65.9,40.26) 66.76,39.41 v1(77.75,39.41) ; U4.59 44.06,49.03 44.31,49.28 55.74,49.28 56.63,50.17 56.63,52.58 56.81,52.76 63.82,52.76 v1(64.25,52.33)
  Bottom Layer w0.254: v1(65.9,40.26) 65.9,51.05 64.62,52.33 v1(64.25,52.33) ; CN31.3 80.43,40.61 78.19,40.61 78.01,40.43 78.01,39.67 v1(77.75,39.41)
M4_ENB: length 59.2
  Top Layer w0.254: U4.60 43.56,49.42 43.81,49.66 55.24,49.66 56.12,50.55 56.12,53.09 56.31,53.27 64.51,53.27 v1(64.98,52.8) ; v1(66.54,37.6) 67.05,37.09 v1(77.72,37.09)
  Bottom Layer w0.254: v1(77.72,37.09) 80.25,37.09 80.49,37.33 CN31.4 ; v1(66.54,37.6) 66.54,51.24 v1(64.98,52.8)
M4_H: length 70
  Top Layer w0.254: 34.51,34.35 33.19,34.35 33.01,34.17 30.72,34.17 30.01,33.46 30.01,14.94 30.17,14.79 v1(31.49,14.79) ; v1(64.13,15.24) 64.13,24.77 63.75,25.15 61.71,25.15 CN28.6
  Bottom Layer w0.254: v1(64.13,15.24) 63.67,14.79 v1(31.49,14.79)
M4_L: length 68.4
  Top Layer w0.254: v1(62.73,13.97) 63.24,14.48 63.24,22.23 62.73,22.74 CN28.8 ; v1(31.49,14.03) 30.04,14.03 29.58,14.48 29.58,33.79 30.34,34.55 32.63,34.55 32.93,34.85 34.51,34.85
  Bottom Layer w0.254: v1(62.73,13.97) 31.54,13.97 v1(31.49,14.03)
M4_PWM: length 61.5
  Top Layer w0.254: U4.61 43.06,49.81 43.43,50.17 54.85,50.17 55.49,50.8 55.49,53.47 55.74,53.73 65.14,53.73 v1(65.78,53.09)
  Bottom Layer w0.254: v1(65.78,53.09) 67.53,51.34 67.53,28.81 66.41,27.69 61.71,27.69 61.59,27.82
OLED_CS: length 57.7
  Top Layer w0.254: v1(48.44,48.07) 48.12,48.07 47.06,47.02 U4.53
  Bottom Layer w0.254: H25.7 86.64,59.69 85.87,60.46 68.69,60.46 67.37,59.13 48.96,59.13 48.44,58.62 v1(48.44,48.07)
OLED_DC: length 52.1
  Top Layer w0.254: v1(49.9,47.76) 49.14,46.99 48.25,46.99 48.06,46.81 U4.51
  Bottom Layer w0.254: v1(49.9,47.76) 49.9,57.92 50.27,58.28 67.67,58.28 68.7,59.31 73.09,59.31 73.72,58.68 83.88,58.68 84.1,58.46 H25.6
OLED_MOSI: length 52.1
  Top Layer w0.254: U4.54 46.56,47.02 47.62,48.07 v1(47.62,48.65) ; v1(78.99,61.22) 79.02,61.18 H25.4
  Bottom Layer w0.254: v1(78.99,61.22) 73,61.22 72.93,61.15 71.29,61.15 71.23,61.22 71,61.22 70.93,61.15 69.29,61.15 69.23,61.22 68.95,61.22 67.22,59.49 48.68,59.49 47.62,58.42 v1(47.62,48.65)
OLED_SCK: length 46.1
  Top Layer w0.254: v1(49.15,48.52) 49.15,47.96 48.68,47.49 48.11,47.49 47.56,46.94 U4.52 ; v1(74.03,59.44) 76.26,59.44 76.48,59.22 H25.3
  Bottom Layer w0.254: v1(49.15,48.52) 49.15,58.44 49.49,58.78 67.52,58.78 68.56,59.82 73.65,59.82 v1(74.03,59.44)
OSC_IN: length 13.1
  Top Layer w0.254: 39.12,21.34 C2_22pf1.2 ; 39.12,21.34 41.02,21.34 ; 39.12,21.34 39.12,24.3 X1.1 39.62,25.01 39.62,28.07 39.87,28.33 41.01,28.33 41.56,28.88 U4.12
OSC_OUT: length 13.1
  Top Layer w0.254: 1M1.2 44.3,21.34 ; 44.3,21.34 C1_22pf1.2 ; 44.3,21.34 44.3,24.42 X1.2 44.06,25.13 44.06,27.94 43.68,28.33 42.66,28.33 42.06,28.92 U4.13
PES1: length 47.7
  Top Layer w0.254: CN15.1 77.91,15.81 v1(77.59,16.13) ; v1(52.82,17.15) 52.82,20.2 52.19,20.83 52.19,33.66 52,33.85 U4.29
  Bottom Layer w0.254: v1(52.82,17.15) 53.2,16.77 56.82,16.77 57.04,16.99 57.53,16.99 57.74,16.77 76.95,16.77 v1(77.59,16.13)
PES2: length 47.1
  Top Layer w0.254: v1(53.84,17.4) 53.33,17.91 53.33,20.45 52.57,21.21 52.57,33.91 52.14,34.35 49.61,34.35 ; v1(77.84,17.91) 79.96,17.91 CN15.2
  Bottom Layer w0.254: v1(77.84,17.91) 72.63,17.91 72.13,17.4 v1(53.84,17.4)
PES3: length 49.4
  Top Layer w0.254: v1(77.26,18.8) 77.26,20.45 77.51,20.71 80.26,20.71 CN15.3 ; v1(54.22,18.55) 53.84,18.93 53.84,20.83 53.2,21.47 53.2,28.9 53.15,28.95 53.15,29.73 53.2,29.78 53.2,35.56 52.92,35.85 U4.33
  Bottom Layer w0.254: v1(54.22,18.55) 54.47,18.29 72.25,18.29 72.76,18.8 v1(77.26,18.8)
PES4: length 50.9
  Top Layer w0.254: CN15.4 80.17,23.12 76.95,23.12 76.44,22.61 v1(76.44,19.56) ; v1(54.73,19.82) 54.73,20.83 53.59,21.98 53.59,29.02 53.51,29.1 53.51,29.58 53.59,29.66 53.59,36.2 53.44,36.35 49.61,36.35
  Bottom Layer w0.254: v1(54.73,19.82) 54.73,19.18 54.89,19.02 62.07,19.02 62.62,19.56 v1(76.44,19.56)
PWMA: length 42.6
  Top Layer w0.254: CN16.1 54.93,9.56 54.93,11.71 55.11,11.89 56.58,11.89 56.76,12.07 56.76,15.88 56.68,15.96 56.68,17.01 56.76,17.09 56.76,25.79 57.4,26.42 57.4,41.79 56.63,42.55 53.2,42.55 52.5,41.85 49.61,41.85
PWMB: length 40
  Top Layer w0.254: v1(57.27,4.45) 52.31,4.45 51.43,5.34 51.43,32.09 51.17,32.35 49.61,32.35 ; v1(57.27,6.99) 57.27,9.4 CN16.2
  Bottom Layer w0.254: v1(57.27,4.45) v1(57.27,6.99)
PWMC: length 46.9
  Top Layer w0.254: 49.61,37.35 54.47,37.35 54.73,37.09 54.73,28.96 54.35,28.58 54.35,24.64 54.73,24.26 54.73,22.48 55.41,21.8 55.41,21.73 55.62,21.53 55.62,13.21 54.98,12.58 53.97,12.58 53.79,12.4 53.79,7.04 54.47,6.35 59.68,6.35 60.06,6.74 60.06,9.4 CN16.3
PWMD: length 81
  Top Layer w0.254: v1(66.92,27.31) 66.92,12.96 66.21,12.25 62.55,12.25 62.42,12.11 CN16.4 ; U4.62 42.56,50.2 42.92,50.55 54.35,50.55 54.98,51.19 54.98,53.98 55.24,54.23 65.9,54.23 66.41,53.73 v1(66.67,53.73)
  Bottom Layer w0.254: v1(66.67,53.73) 67.88,52.51 67.88,28.27 v1(66.92,27.31)
RESET: length 104.5
  Top Layer w0.254: v1(66.28,34.93) 66.54,34.68 v1(75.81,34.68) ; v1(45.71,11.94) 45.78,12.01 46.85,12.01 47.03,12.19 47.03,13.9 48.03,14.9 48.04,14.9 48.14,15 49.18,15 49.33,15.16 49.33,25.29 49.18,25.44 48.67,25.44 47.32,26.78 46.56,26.78 45.56,27.79 45.56,28.05 45.31,28.3 44.7,28.3 43.54,29.46 43.05,29.46 42.56,29.95 U4.14 42.56,34.39 42.23,34.73 v1(42.23,36.33) ; RESET1.1 38.6,6.24 v1(38.6,7.5)
  Bottom Layer w0.254: v1(45.71,11.94) 41.77,11.94 41.2,11.37 C39.1 R30.2 38.6,9.89 v1(38.6,7.5) ; v1(66.28,34.93) 64.51,36.71 42.66,36.71 42.28,36.33 v1(42.23,36.33) ; H25.5 81.56,53.64 81.31,53.38 76.35,53.38 76.18,53.2 76.18,35.17 75.85,34.84
SWCLK: length 25.5
  Top Layer w0.254: 34.51,44.35 34.5,44.33 31.87,44.33 31.69,44.51 31.69,59.01 31.87,59.19 33.52,59.19 33.82,59.48 R10_10K3.2 33.83,61.36 CN6.4
SWDIO: length 25.5
  Top Layer w0.254: U4.72 37.56,55.85 37.38,56.03 34.84,56.03 34.66,56.21 34.66,57.38 34.84,57.56 37.38,57.56 37.56,57.74 37.56,58.81 37.31,59.06 36.82,59.06 36.58,59.3 R10_10K2.2 36.58,65.02 CN6.3
USART1_RX: length 24.7
  Top Layer w0.254: v1(40.5,51.57) 39.53,51.57 39.06,51.1 U4.69
  Bottom Layer w0.254: v1(40.5,51.57) 40.5,59.57 40.88,59.95 40.88,61.85 40.63,62.11 36.95,62.11 36.57,62.49 36.57,65.03 CN3.2
USART1_TX: length 24.8
  Top Layer w0.254: v1(39.74,50.8) 39.56,50.63 U4.68
  Bottom Layer w0.254: CN3.1 33.83,62.17 34.41,61.6 39.36,61.6 39.74,61.22 v1(39.74,50.8)
USART2_RX: length 30.3
  Top Layer w0.254: v1(29.58,38.87) 29.6,38.85 34.51,38.85
  Bottom Layer w0.254: CN2.2 12.2,36.47 12.49,36.76 12.49,40.32 12.74,40.57 26.61,40.57 26.79,40.39 26.79,38.99 26.91,38.87 v1(29.58,38.87)
USART2_TX: length 30.3
  Top Layer w0.254: 34.51,39.35 32.28,39.35 32,39.63 v1(26.03,39.63)
  Bottom Layer w0.254: v1(26.03,39.63) 13.71,39.63 13.33,39.25 13.33,34.29 13,33.97 CN2.1
USART3_RX: length 44.3
  Top Layer w0.254: v1(63.11,56.77) 63.11,67.7 64,68.58 v1(67.05,68.58) ; v1(52.44,47.76) 52.44,44.96 50.83,43.35 U4.48
  Bottom Layer w0.254: 67.19,65.39 67.19,68.44 v1(67.05,68.58) ; v1(52.44,47.76) 52.44,56.52 52.7,56.77 v1(63.11,56.77)
USART3_TX: length 37.4
  Top Layer w0.254: v1(65.69,63.01) 65.69,57.33 v1(64.89,56.52) ; v1(53.33,47.88) 53.33,44.71 51.47,42.85 49.61,42.85
  Bottom Layer w0.254: v1(65.69,63.01) 65.01,63.01 64.69,63.32 CN4.1 ; v1(53.33,47.88) 53.33,55.76 53.71,56.14 64.51,56.14 v1(64.89,56.52)
USART4_RX: length 29.2
  Top Layer w0.254: v1(29.58,42.87) 34.49,42.87 34.51,42.85 ; CN5.2 11.78,38.97 12.06,39.25 12.06,42.8 12.69,43.44 v1(13.07,43.44)
  Bottom Layer w0.254: v1(13.07,43.44) 28.31,43.44 28.88,42.87 v1(29.58,42.87)
USART4_TX: length 29.2
  Top Layer w0.254: v1(29.58,43.82) 31.36,43.82 31.83,43.35 34.51,43.35 ; CN5.1 9.26,41.74 9.26,43.57 9.52,43.82 10.17,43.82 10.35,43.64 10.35,43.36 10.53,43.18 11.17,43.18 11.42,43.44 11.42,44.07 11.6,44.25 v1(12.95,44.25)
  Bottom Layer w0.254: v1(12.95,44.25) 28.51,44.25 28.95,43.82 v1(29.58,43.82)
USART5_RX: length 46.3
  Top Layer w0.254: CN25.2 13.56,19.54 14.09,20.07 14.09,41.03 v1(14.47,41.41) ; v1(29.58,40.9) 29.63,40.85 34.51,40.85
  Bottom Layer w0.254: v1(29.58,40.9) 28.44,40.9 27.93,41.41 v1(14.47,41.41)
USART5_TX: length 46.4
  Top Layer w0.254: 34.51,42.35 32.17,42.35 31.74,41.91 v1(29.58,41.91) ; CN25.1 9.93,22.18 12.77,22.18 13.07,22.49 13.07,25.02 12.87,25.23 12.36,25.23 12.18,25.4 12.18,26.17 12.44,26.42 12.95,26.42 13.07,26.55 13.07,41.91 v1(13.71,42.55)
  Bottom Layer w0.254: v1(13.71,42.55) 28.06,42.55 28.69,41.91 v1(29.58,41.91)
USART6_RX: length 62.2
  Top Layer w0.254: v1(67.68,55.12) 67.17,55.63 54.35,55.63 53.97,55.25 53.97,51.95 53.67,51.65 52.23,51.65 51.75,52.13 50.84,52.13 50.33,51.61 42.45,51.61 41.56,50.72 U4.64 ; CN29.2 80.47,40.64 v1(68.82,40.64)
  Bottom Layer w0.254: v1(67.68,55.12) 67.81,55.12 68.7,54.23 68.7,40.77 v1(68.82,40.64)
USART6_TX: length 62.3
  Top Layer w0.254: CN29.1 80.43,38.23 v1(68.7,38.23) ; v1(67.3,54.36) 66.67,55 54.85,55 54.47,54.61 54.47,51.57 53.97,51.06 42.54,51.06 42.06,50.59 U4.63
  Bottom Layer w0.254: v1(67.3,54.36) 68.24,53.42 68.24,38.69 v1(68.7,38.23)
$1N12245: length 10
  Bottom Layer w0.254: R29_10K1.2 80.76,30.1 81.27,29.6 81.27,28.58 81.53,28.33 85.21,28.33 85.46,28.58 85.46,29.85 H8.2
$1N12257: length 3.7
  Top Layer w0.635: 6.17,47.45 6.35,47.63 R10_10K1.2
$1N12259: length 2.9
  Top Layer w0.254: v1(48.12,43.59) 48.51,43.59 48.76,43.85 49.61,43.85
  Bottom Layer w0.254: C44.1 47.03,43.59 v1(48.12,43.59)
$1N12262: length 26.2
  Top Layer w0.254: v1(45.71,39.63) 46.22,39.63 46.56,39.28 U4.22 ; v1(45.71,37.85) 46.06,37.5 U4.21
  Bottom Layer w0.254: 43.67,43.31 43.69,43.29 43.69,39.63 ; v1(45.71,39.63) 43.69,39.63 ; 43.69,39.63 C33_2.2uf1.2 v1(45.71,37.85) ; 43.69,39.63 C34_106.1
$1N12267: length 3.8
  Top Layer w0.635: R13_10K1.2 6.03,52.84 5V1.1
$1N12270: length 2.6
  Top Layer w0.254: U4.73 37.07,45.89 v1(37.07,44.58)
  Bottom Layer w0.254: C45.1 37.07,43.45 v1(37.07,44.58)
$1N12352: length 8
  Bottom Layer w0.254: H7.2 4.82,28.96 5.33,29.47 9.9,29.47 10.28,29.09 10.28,27.83 10K.2
$1N12469: length 8.6
  Top Layer w0.254: v1(20.82,12.7) 21.2,13.09 key4.1
  Bottom Layer w0.254: 17.07,10.16 17.2,10.04 R31_1K1.2 20.82,10.15 v1(20.82,12.7)
$1N12473: length 8.8
  Top Layer w0.254: key2.1 32.77,5.85 30.72,5.85 30.47,5.59 v1(30.47,4.7)
  Bottom Layer w0.254: C56.1 R7_1K1.2 30.36,4.59 v1(30.47,4.7)
$1N12474: length 8.3
  Top Layer w0.254: v1(21.2,5.59) 21.58,5.97 key3.1
  Bottom Layer w0.254: v1(21.2,5.59) 21.2,3.16 R8_1K1.2 C57.1
$1N12475: length 9
  Top Layer w0.254: key1.1 32.9,12.96 30.72,12.96 30.55,12.78 v1(30.55,12.07)
  Bottom Layer w0.254: C1.1 R6_1k1.2 30.55,10.1 v1(30.55,12.07)
$1N12476: length 3.7
  Top Layer w0.254: R13_2K1.2 24.34,25.28
$1N12492: length 3.7
  Top Layer w0.254: R10_2K1.2 24.34,21.98
$1N22147: length 3.7
  Top Layer w0.254: R10_2K2.2 24.34,18.55
$1N59236: length 12.2
  Top Layer w0.254: F3.1 53.71,59.24 D1.1 53.27,54.42 52.95,54.11 U13.6
$1N59237: length 12.2
  Top Layer w0.254: F4.1 50.92,59.24 D1.2 51.37,55.44 51.26,55.34 50.7,55.34 50.61,55.43 50.61,56.83 50.41,57.03 49.84,57.03 49.72,56.91 49.72,55.58 49.48,55.34 47.95,55.34 U13.7
$1N59244: length 3.2
  Top Layer w0.254: R20.2 53.79,65.98 C27.1 52.25,65.92 R19.1

## Copper pours and planes (outline as drawn; the poured copper is in the pictures)
GND on Top Layer: -1.5,75.86 92.48,75.86 92.48,-2.62 -1.5,-2.62
GND on Bottom Layer: -2.64,76.37 92.86,76.37 92.86,-4.28 -2.64,-4.28
VCC3V3 on Top Layer: 23.11,68.58 28.19,68.58 28.19,63.5 23.11,63.5
VCC5V on Top Layer: 10.91,64.9 18.15,64.9 18.15,51.57 10.91,51.57
VCC5V on Top Layer: 23.11,74.43 28.19,74.43 28.19,69.35 23.11,69.35
POWER5V on Top Layer: 5.83,65.03 10.03,65.03 10.03,54.87 5.83,54.87
$1N12322 on Top Layer: 10.79,71.76 14.72,71.76 14.72,61.98 10.79,61.98

Small or netless copper shapes (teardrops, artwork), in the pictures only: 317 on Top Layer, 203 on Bottom Layer

## Text on the board
Bottom Silkscreen Layer: 10K | 5V | GND | RX2 | TX2 | M3_ENB | M4_ENB | M1_ENA | M3_ENA | M4_ENA | M1_ENB | M2_ENA | M2_ENB | TX1 | RX1 | TX3 | RX3
Top Silkscreen Layer: 5V | GND | CAN_L | PWMA | PWMB | PWMC | PWMD | OFF | 5V_IN | ON | 3V3 | 22pf | CLK | DIO | SCK | MOSI | R | DC | CS | 3 | B0 | G | F4 | F3 | F2 | F1 | B1 | TX4 | RX4 | RX6 | TX6 | TX5 | RX5 | PES3 | PES4 | PES2 | PES1 | PW / M1 | PW / M3 | PW / M2 | PW / M4 | 1H | 3H | 1L | 3L | 2H | 2L | 4H | 4L
